# Altium schematic sheet Stepdown 5V 1A.SchDoc
size A
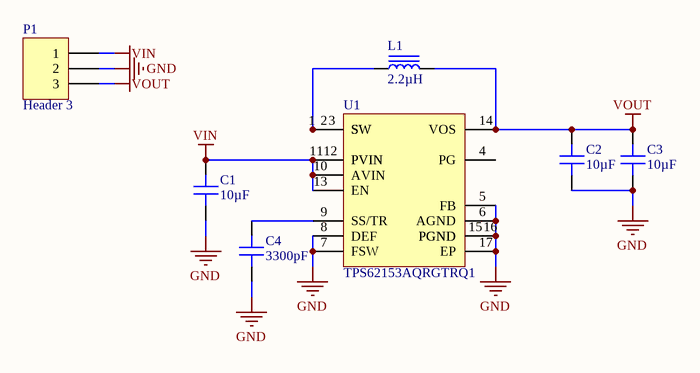
[diagram p0: Stepdown 5V 1A.SchDoc]

## Parts
C1  10µF  [CAP 0805_2012]
C2  10µF  [CAP 0805_2012]
C3  10µF  [CAP 0805_2012]
C4  3300pF  [CAP 0603_1608]
L1  2.2µH  [IND 0806_2016]
P1  Header 3  [HDR1X3]
U1  TPS62153AQRGTRQ1  [16-VFQFN Exposed Pad]

## Nets
GND: C1.1 C2.1 C3.1 C4.1 P1.2 U1.5(FB) U1.6(AGND) U1.7(FSW) U1.8(DEF) U1.15(PGND) U1.16(PGND) U1.17(EP)
VIN: C1.2 P1.1 U1.10(AVIN) U1.11(PVIN) U1.12(PVIN) U1.13(EN)
VOUT: C2.2 C3.2 L1.2 P1.3 U1.14(VOS)
NetC4_2: C4.2 U1.9(SS/TR)
NetL1_1: L1.1 U1.1(SW) U1.2(SW) U1.3(SW)

Not connected (* = marked no-connect by the designer): U1 4(PG)

## Library data of the parts
C1-C3 = C2012X5R1E106K085AC: CAP CER 10UF 25V X5R 0805; Manufacturer: TDK Corporation; Tolerance: ±10%; Part Number: C2012X5R1E106K085AC; Value: 10µF; Applications: General Purpose; Capacitance: 10µF; ComponentLink1Description: Datasheet; ComponentLink1URL: https://product.tdk.com/info/en/catalog/datasheets/mlcc_commercial_general_en.pdf?ref_disty=digikey; ComponentLink2Description: DigiKey Link; ComponentLink2URL: http://digikey.com/product-detail/en/tdk-corporation/C2012X5R1E106K085AC/445-14387-1-ND/3956053; Device Package: 0805 (2012 Metric); Features: Low ESL; LastUpdated: 1/21/2020 12:02:45 AM; Lifecycle Status: Active; Minimum Order: 1; Mounting Type: Surface Mount, MLCC; Operating Temperature: -55°C ~ 85°C; Package / Case: 0805 (2012 Metric); Packaging: TapeAndReel; PartId: 15274; Part Status: Active; Price: 0.15; Series: C; Size / Dimension: 0.079" L x 0.049" W (2.00mm x 1.25mm); Supplier 1: DigiKey; Supplier Part Number 1: 445-14387-1-ND; Temperature Coefficient: X5R; Thickness (Max): 0.039" (1.00mm); Voltage - Rated: 25V
C4 = 06031C332K4T2A: CAP CER 3300PF 100V X7R 0603; Manufacturer: AVX Corporation; Tolerance: ±10%; Part Number: 06031C332K4T2A; Value: 3300pF; Applications: Automotive; Capacitance: 3300pF; ComponentLink1Description: Datasheet; ComponentLink1URL: http://datasheets.avx.com/AutoMLCC.pdf; ComponentLink2Description: DigiKey Link; ComponentLink2URL: http://digikey.com/product-detail/en/avx-corporation/06031C332K4T2A/478-9863-1-ND/6002696; Device Package: 0603 (1608 Metric); LastUpdated: 9/2/2020 1:03:27 AM; Lifecycle Status: Active; Minimum Order: 1; Mounting Type: Surface Mount, MLCC; Operating Temperature: -55°C ~ 125°C; Package / Case: 0603 (1608 Metric); Packaging: TapeAndReel; PartId: 7242; Part Status: Active; Price: 0.02; Ratings: AEC-Q200; Series: -; Size / Dimension: 0.063" L x 0.032" W (1.60mm x 0.81mm); Supplier 1: DigiKey; Supplier Part Number 1: 478-9863-1-ND; Temperature Coefficient: X7R; Thickness (Max): 0.035" (0.90mm); Voltage - Rated: 100V
L1 = CIGW201610GH2R2MLE: FIXED IND 2.2UH 1.8A 117MOHM; Manufacturer: Samsung Electro-Mechanics; Current - Saturation: 2.8A; DC Resistance (DCR): 117mOhm Max; Inductance Frequency - Test: 1MHz; Material - Core: Metal Composite; Shielding: Unshielded; Tolerance: ±20%; Type: Wirewound; Part Number: CIGW201610GH2R2MLE; ComponentLink1Description: Datasheet; ComponentLink1URL: http://www.samsungsem.com/kr/support/product-search/inductor/CIGW201610GH2R2MLE.jsp; ComponentLink2Description: DigiKey Link; ComponentLink2URL: http://digikey.com/product-detail/en/samsung-electro-mechanics/CIGW201610GH2R2MLE/1276-6905-1-ND/7041305; Current Rating (Amps): 1.8A; Device Package: 0806 (2016 Metric); Height - Seated (Max): 0.039" (1.00mm); Inductance: 2.2µH; LastUpdated: 9/2/2020 1:24:35 AM; Lifecycle Status: Active; Minimum Order: 1; Mounting Type: Surface Mount; Operating Temperature: -40°C ~ 125°C; Package / Case: 0806 (2016 Metric); PartId: 3764; Part Status: Active; Price: 0; Series: CIGW; Size / Dimension: 0.079" L x 0.063" W (2.00mm x 1.60mm); Supplier 1: DigiKey; Supplier Part Number 1: 1276-6905-1-ND; Supplier Device Package: 0806 (2016 Metric); Value: 2.2µH
P1 = Header 3: Header, 3-Pin; LatestRevisionDate: 17-Jul-2002; LatestRevisionNote: Re-released for DXP Platform.; Publisher: Altium Limited
U1 = TPS62153AQRGTRQ1: Buck Switching Regulator IC Positive Fixed 5V 1 Output 1A 16-VFQFN Exposed Pad; MF: Texas Instruments; MP: TPS62153AQRGTRQ1